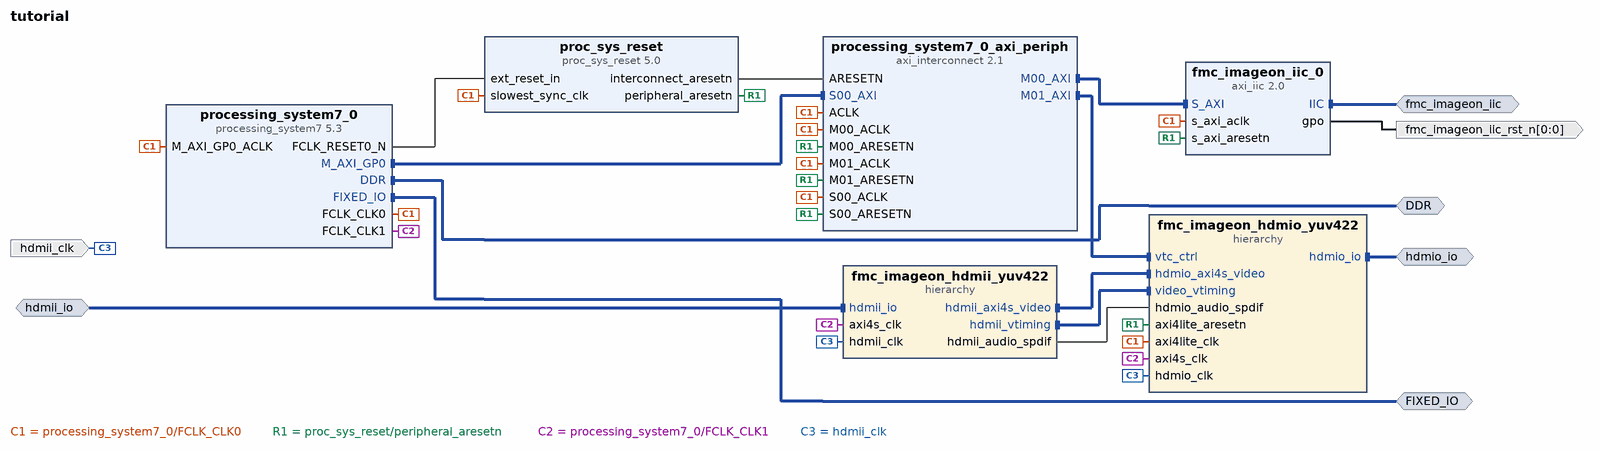
[diagram p0: block diagram of the top level]
# Vivado block design tutorial, Vivado 2013.3
create_bd_design tutorial

create_bd_intf_port -mode Master -vlnv xilinx.com:interface:ddrx_rtl:1.0 DDR
create_bd_intf_port -mode Master -vlnv xilinx.com:display_processing_system7:fixedio_rtl:1.0 FIXED_IO
create_bd_intf_port -mode Master -vlnv xilinx.com:interface:iic_rtl:1.0 fmc_imageon_iic
create_bd_intf_port -mode Master -vlnv avnet.com:interface:avnet_hdmi_rtl:1.0 hdmio_io
create_bd_intf_port -mode Slave -vlnv avnet.com:interface:avnet_hdmi_rtl:1.0 hdmii_io
create_bd_port -dir O -from 0 -to 0 fmc_imageon_iic_rst_n
create_bd_port -dir I -type clk hdmii_clk

create_bd_cell -type ip -vlnv xilinx.com:ip:processing_system7:5.3 processing_system7_0
set_property -dict [list \
  CONFIG.PCW_FPGA1_PERIPHERAL_FREQMHZ 150 \
  CONFIG.PCW_EN_CLK1_PORT 1 \
  CONFIG.preset {ZC702*} \
] [get_bd_cells processing_system7_0]
create_bd_cell -type ip -vlnv xilinx.com:ip:axi_iic:2.0 fmc_imageon_iic_0
set_property -dict {CONFIG.USE_BOARD_FLOW true CONFIG.IIC_BOARD_INTERFACE Custom} [get_bd_cells fmc_imageon_iic_0]
create_bd_cell -type ip -vlnv xilinx.com:ip:axi_interconnect:2.1 processing_system7_0_axi_periph
set_property -dict {CONFIG.NUM_MI 2} [get_bd_cells processing_system7_0_axi_periph]
create_bd_cell -type ip -vlnv xilinx.com:ip:proc_sys_reset:5.0 proc_sys_reset
create_bd_cell -type hier fmc_imageon_hdmii_yuv422
create_bd_cell -type hier fmc_imageon_hdmio_yuv422

# ---- hierarchy /fmc_imageon_hdmii_yuv422 ----
current_bd_instance /fmc_imageon_hdmii_yuv422
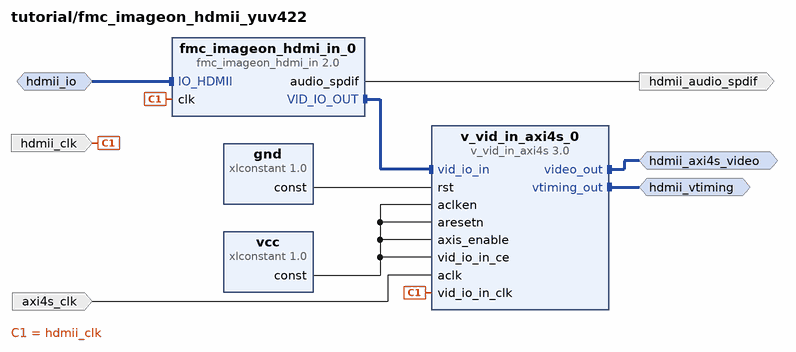
[diagram p1: block diagram inside /fmc_imageon_hdmii_yuv422]
create_bd_intf_pin -mode Master -vlnv xilinx.com:interface:axis_rtl:1.0 hdmii_axi4s_video
create_bd_intf_pin -mode Slave -vlnv avnet.com:interface:avnet_hdmi_rtl:1.0 hdmii_io
create_bd_intf_pin -mode Master -vlnv xilinx.com:interface:video_timing_rtl:2.0 hdmii_vtiming
create_bd_pin -dir I -type clk axi4s_clk
create_bd_pin -dir O hdmii_audio_spdif
create_bd_pin -dir I -type clk hdmii_clk

create_bd_cell -type ip -vlnv avnet:fmc_imageon:fmc_imageon_hdmi_in:2.0 fmc_imageon_hdmi_in_0
create_bd_cell -type ip -vlnv xilinx.com:ip:xlconstant:1.0 gnd
set_property -dict {CONFIG.CONST_VAL 0} [get_bd_cells gnd]
create_bd_cell -type ip -vlnv xilinx.com:ip:v_vid_in_axi4s:3.0 v_vid_in_axi4s_0
set_property -dict {CONFIG.C_M_AXIS_VIDEO_FORMAT 0} [get_bd_cells v_vid_in_axi4s_0]
create_bd_cell -type ip -vlnv xilinx.com:ip:xlconstant:1.0 vcc

# ---- hierarchy /fmc_imageon_hdmio_yuv422 ----
current_bd_instance /fmc_imageon_hdmio_yuv422
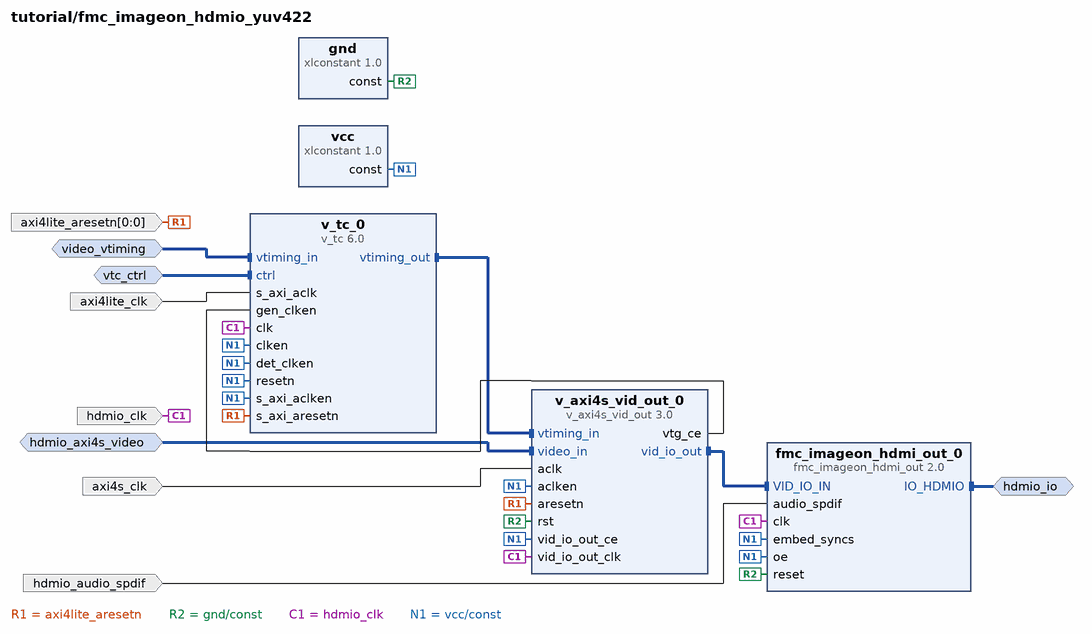
[diagram p2: block diagram inside /fmc_imageon_hdmio_yuv422]
create_bd_intf_pin -mode Slave -vlnv xilinx.com:interface:axis_rtl:1.0 hdmio_axi4s_video
create_bd_intf_pin -mode Master -vlnv avnet.com:interface:avnet_hdmi_rtl:1.0 hdmio_io
create_bd_intf_pin -mode Slave -vlnv xilinx.com:interface:video_timing_rtl:2.0 video_vtiming
create_bd_intf_pin -mode Slave -vlnv xilinx.com:interface:aximm_rtl:1.0 vtc_ctrl
create_bd_pin -dir I -from 0 -to 0 axi4lite_aresetn
create_bd_pin -dir I axi4lite_clk
create_bd_pin -dir I -type clk axi4s_clk
create_bd_pin -dir I hdmio_audio_spdif
create_bd_pin -dir I hdmio_clk

create_bd_cell -type ip -vlnv avnet:fmc_imageon:fmc_imageon_hdmi_out:2.0 fmc_imageon_hdmi_out_0
create_bd_cell -type ip -vlnv xilinx.com:ip:xlconstant:1.0 gnd
set_property -dict {CONFIG.CONST_VAL 0} [get_bd_cells gnd]
create_bd_cell -type ip -vlnv xilinx.com:ip:v_axi4s_vid_out:3.0 v_axi4s_vid_out_0
create_bd_cell -type ip -vlnv xilinx.com:ip:v_tc:6.0 v_tc_0
set_property -dict [list \
  CONFIG.VIDEO_MODE 1080p \
  CONFIG.horizontal_sync_detection false \
  CONFIG.auto_generation_mode true \
  CONFIG.vertical_sync_detection false \
] [get_bd_cells v_tc_0]
create_bd_cell -type ip -vlnv xilinx.com:ip:xlconstant:1.0 vcc

# ---- connections ----

current_bd_instance /fmc_imageon_hdmii_yuv422
connect_bd_intf_net [get_bd_intf_pins fmc_imageon_hdmi_in_0/VID_IO_OUT] [get_bd_intf_pins v_vid_in_axi4s_0/vid_io_in]
connect_bd_intf_net [get_bd_intf_pins hdmii_axi4s_video] [get_bd_intf_pins v_vid_in_axi4s_0/video_out]
connect_bd_intf_net [get_bd_intf_pins hdmii_io] [get_bd_intf_pins fmc_imageon_hdmi_in_0/IO_HDMII]
connect_bd_intf_net [get_bd_intf_pins hdmii_vtiming] [get_bd_intf_pins v_vid_in_axi4s_0/vtiming_out]
connect_bd_net -net clk_1 [get_bd_pins hdmii_clk] [get_bd_pins fmc_imageon_hdmi_in_0/clk] [get_bd_pins v_vid_in_axi4s_0/vid_io_in_clk]
connect_bd_net [get_bd_pins fmc_imageon_hdmi_in_0/audio_spdif] [get_bd_pins hdmii_audio_spdif]
connect_bd_net [get_bd_pins gnd/const] [get_bd_pins v_vid_in_axi4s_0/rst]
connect_bd_net -net processing_system7_0_fclk_clk1 [get_bd_pins axi4s_clk] [get_bd_pins v_vid_in_axi4s_0/aclk]
connect_bd_net [get_bd_pins vcc/const] \
  [get_bd_pins v_vid_in_axi4s_0/aclken] [get_bd_pins v_vid_in_axi4s_0/aresetn] [get_bd_pins v_vid_in_axi4s_0/axis_enable] \
  [get_bd_pins v_vid_in_axi4s_0/vid_io_in_ce]

current_bd_instance /fmc_imageon_hdmio_yuv422
connect_bd_intf_net [get_bd_intf_pins fmc_imageon_hdmi_out_0/VID_IO_IN] [get_bd_intf_pins v_axi4s_vid_out_0/vid_io_out]
connect_bd_intf_net [get_bd_intf_pins v_axi4s_vid_out_0/vtiming_in] [get_bd_intf_pins v_tc_0/vtiming_out]
connect_bd_intf_net -intf_net v_vid_in_axi4s_0_video_out [get_bd_intf_pins hdmio_axi4s_video] [get_bd_intf_pins v_axi4s_vid_out_0/video_in]
connect_bd_intf_net [get_bd_intf_pins hdmio_io] [get_bd_intf_pins fmc_imageon_hdmi_out_0/IO_HDMIO]
connect_bd_intf_net [get_bd_intf_pins video_vtiming] [get_bd_intf_pins v_tc_0/vtiming_in]
connect_bd_intf_net [get_bd_intf_pins vtc_ctrl] [get_bd_intf_pins v_tc_0/ctrl]
connect_bd_net [get_bd_pins axi4lite_aresetn] [get_bd_pins v_axi4s_vid_out_0/aresetn] [get_bd_pins v_tc_0/s_axi_aresetn]
connect_bd_net [get_bd_pins axi4lite_clk] [get_bd_pins v_tc_0/s_axi_aclk]
connect_bd_net [get_bd_pins axi4s_clk] [get_bd_pins v_axi4s_vid_out_0/aclk]
connect_bd_net [get_bd_pins gnd/const] [get_bd_pins fmc_imageon_hdmi_out_0/reset] [get_bd_pins v_axi4s_vid_out_0/rst]
connect_bd_net [get_bd_pins hdmio_audio_spdif] [get_bd_pins fmc_imageon_hdmi_out_0/audio_spdif]
connect_bd_net [get_bd_pins hdmio_clk] \
  [get_bd_pins fmc_imageon_hdmi_out_0/clk] [get_bd_pins v_axi4s_vid_out_0/vid_io_out_clk] [get_bd_pins v_tc_0/clk]
connect_bd_net [get_bd_pins v_axi4s_vid_out_0/vtg_ce] [get_bd_pins v_tc_0/gen_clken]
connect_bd_net [get_bd_pins vcc/const] \
  [get_bd_pins fmc_imageon_hdmi_out_0/embed_syncs] [get_bd_pins fmc_imageon_hdmi_out_0/oe] \
  [get_bd_pins v_axi4s_vid_out_0/aclken] [get_bd_pins v_axi4s_vid_out_0/vid_io_out_ce] [get_bd_pins v_tc_0/clken] \
  [get_bd_pins v_tc_0/det_clken] [get_bd_pins v_tc_0/resetn] [get_bd_pins v_tc_0/s_axi_aclken]

current_bd_instance /
connect_bd_intf_net [get_bd_intf_pins processing_system7_0/M_AXI_GP0] [get_bd_intf_pins processing_system7_0_axi_periph/S00_AXI]
connect_bd_intf_net [get_bd_intf_pins processing_system7_0_axi_periph/M00_AXI] [get_bd_intf_pins fmc_imageon_iic_0/S_AXI]
connect_bd_intf_net [get_bd_intf_pins processing_system7_0_axi_periph/M01_AXI] [get_bd_intf_pins fmc_imageon_hdmio_yuv422/vtc_ctrl]
connect_bd_intf_net [get_bd_intf_pins fmc_imageon_hdmii_yuv422/hdmii_axi4s_video] [get_bd_intf_pins fmc_imageon_hdmio_yuv422/hdmio_axi4s_video]
connect_bd_intf_net [get_bd_intf_pins fmc_imageon_hdmii_yuv422/hdmii_vtiming] [get_bd_intf_pins fmc_imageon_hdmio_yuv422/video_vtiming]
connect_bd_intf_net [get_bd_intf_ports DDR] [get_bd_intf_pins processing_system7_0/DDR]
connect_bd_intf_net [get_bd_intf_ports FIXED_IO] [get_bd_intf_pins processing_system7_0/FIXED_IO]
connect_bd_intf_net [get_bd_intf_ports fmc_imageon_iic] [get_bd_intf_pins fmc_imageon_iic_0/IIC]
connect_bd_intf_net [get_bd_intf_ports hdmio_io] [get_bd_intf_pins fmc_imageon_hdmio_yuv422/hdmio_io]
connect_bd_intf_net [get_bd_intf_ports hdmii_io] [get_bd_intf_pins fmc_imageon_hdmii_yuv422/hdmii_io]
connect_bd_net [get_bd_pins processing_system7_0/FCLK_CLK0] \
  [get_bd_pins processing_system7_0/M_AXI_GP0_ACLK] [get_bd_pins processing_system7_0_axi_periph/S00_ACLK] \
  [get_bd_pins proc_sys_reset/slowest_sync_clk] [get_bd_pins processing_system7_0_axi_periph/ACLK] \
  [get_bd_pins fmc_imageon_iic_0/s_axi_aclk] [get_bd_pins processing_system7_0_axi_periph/M00_ACLK] \
  [get_bd_pins processing_system7_0_axi_periph/M01_ACLK] [get_bd_pins fmc_imageon_hdmio_yuv422/axi4lite_clk]
connect_bd_net [get_bd_pins processing_system7_0/FCLK_RESET0_N] [get_bd_pins proc_sys_reset/ext_reset_in]
connect_bd_net [get_bd_pins proc_sys_reset/peripheral_aresetn] \
  [get_bd_pins processing_system7_0_axi_periph/S00_ARESETN] [get_bd_pins fmc_imageon_iic_0/s_axi_aresetn] \
  [get_bd_pins processing_system7_0_axi_periph/M00_ARESETN] [get_bd_pins processing_system7_0_axi_periph/M01_ARESETN] \
  [get_bd_pins fmc_imageon_hdmio_yuv422/axi4lite_aresetn]
connect_bd_net [get_bd_pins proc_sys_reset/interconnect_aresetn] [get_bd_pins processing_system7_0_axi_periph/ARESETN]
connect_bd_net [get_bd_pins fmc_imageon_iic_0/gpo] [get_bd_ports fmc_imageon_iic_rst_n]
connect_bd_net -net axi4s_clk_1 [get_bd_pins processing_system7_0/FCLK_CLK1] \
  [get_bd_pins fmc_imageon_hdmii_yuv422/axi4s_clk] [get_bd_pins fmc_imageon_hdmio_yuv422/axi4s_clk]
connect_bd_net [get_bd_ports hdmii_clk] [get_bd_pins fmc_imageon_hdmii_yuv422/hdmii_clk] [get_bd_pins fmc_imageon_hdmio_yuv422/hdmio_clk]
connect_bd_net -net hdmio_audio_spdif_1 [get_bd_pins fmc_imageon_hdmii_yuv422/hdmii_audio_spdif] \
  [get_bd_pins fmc_imageon_hdmio_yuv422/hdmio_audio_spdif]

# ---- address map ----
assign_bd_address -offset 0x41600000 -range 64K -target_address_space [get_bd_addr_spaces processing_system7_0/Data] [get_bd_addr_segs fmc_imageon_iic_0/S_AXI/Reg]
assign_bd_address -offset 0x43C00000 -range 64K -target_address_space [get_bd_addr_spaces processing_system7_0/Data] [get_bd_addr_segs fmc_imageon_hdmio_yuv422/v_tc_0/ctrl/Reg]

validate_bd_design
save_bd_design
